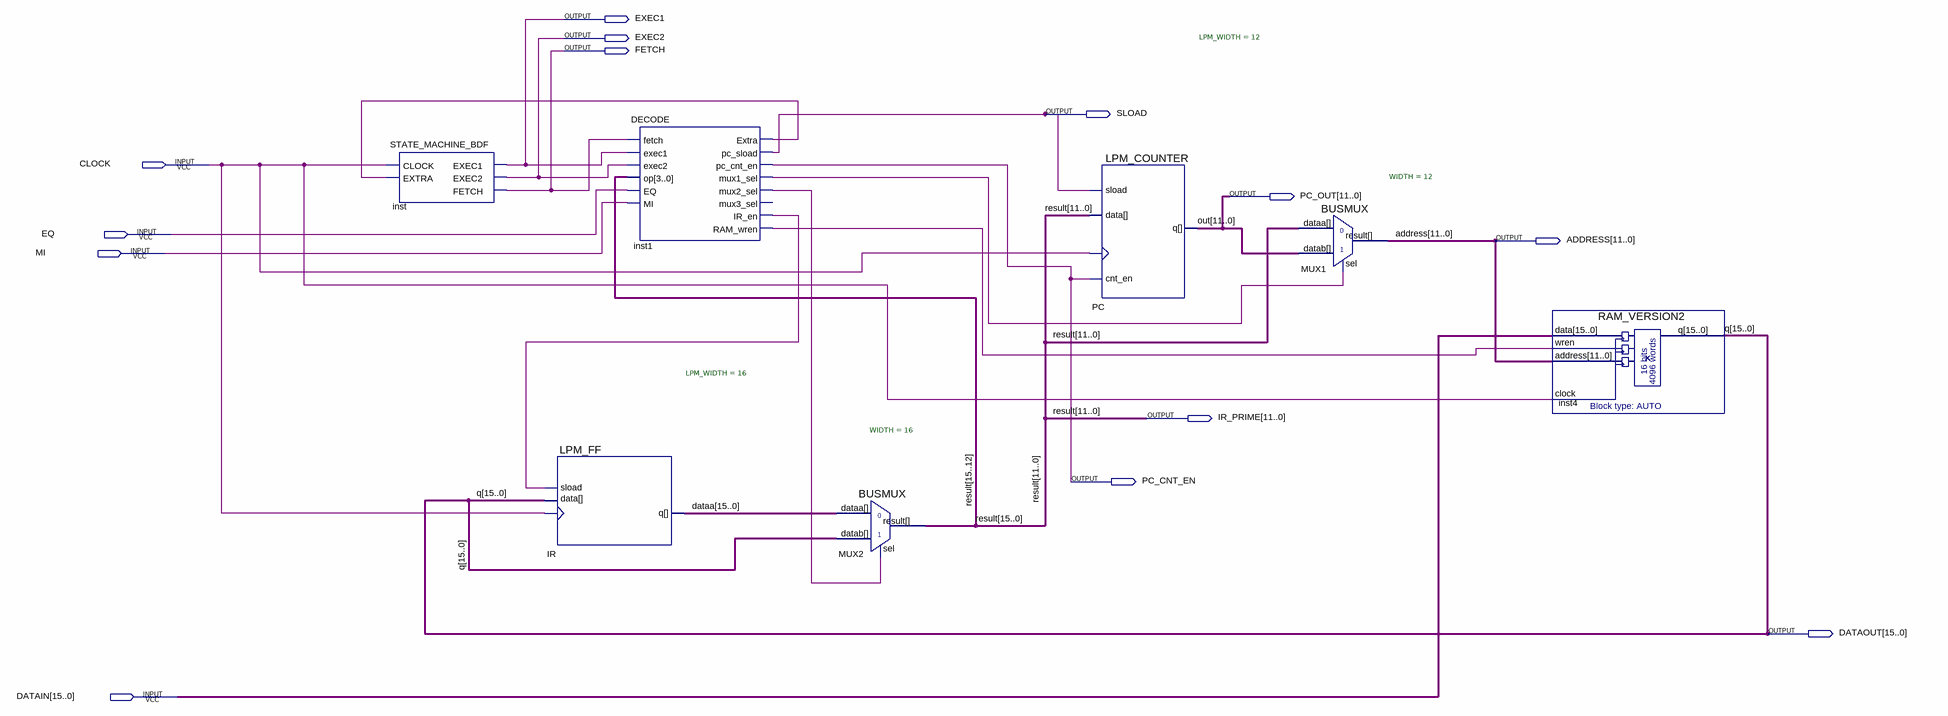
[diagram p0: schematic sheet]
// Quartus schematic TASK5.bdf as structural Verilog: 7 symbols, 13 pins
module TASK5 (
  input  CLOCK,
  input  EQ,
  input  MI,
  input  [15:0] DATAIN,
  output EXEC1,
  output EXEC2,
  output FETCH,
  output SLOAD,
  output [11:0] PC_OUT,
  output [11:0] ADDRESS,
  output [11:0] IR_PRIME,
  output PC_CNT_EN,
  output [15:0] DATAOUT
);

  wire inst1_extra, inst1_ir_en, inst1_mux1_sel, inst1_mux2_sel, inst1_ram_wren;
  wire [15:0] dataa;
  wire [15:12] result;

  STATE_MACHINE_BDF inst (.CLOCK(CLOCK), .EXTRA(inst1_extra), .EXEC1(EXEC1), .EXEC2(EXEC2), .FETCH(FETCH));
  LPM_FF #(.LPM_WIDTH(16)) IR (.clock(CLOCK), .data(DATAOUT), .sload(inst1_ir_en), .q(dataa));
  DECODE inst1 (
    .fetch(FETCH), .exec1(EXEC1), .exec2(EXEC2), .op(result), .EQ(EQ), .MI(MI), .Extra(inst1_extra),
    .pc_sload(SLOAD), .pc_cnt_en(PC_CNT_EN), .mux1_sel(inst1_mux1_sel), .mux2_sel(inst1_mux2_sel),
    .IR_en(inst1_ir_en), .RAM_wren(inst1_ram_wren));  // open: mux3_sel
  BUSMUX #(.WIDTH(16)) MUX2 (.datab(DATAOUT), .sel(inst1_mux2_sel), .dataa(dataa), .result({result, IR_PRIME}));
  LPM_COUNTER #(.LPM_WIDTH(12)) PC (.clock(CLOCK), .cnt_en(PC_CNT_EN), .data(IR_PRIME), .sload(SLOAD), .q(PC_OUT));
  BUSMUX #(.WIDTH(12)) MUX1 (.datab(PC_OUT), .sel(inst1_mux1_sel), .dataa(IR_PRIME), .result(ADDRESS));
  RAM_VERSION2 inst4 (.data(DATAIN), .wren(inst1_ram_wren), .address(ADDRESS), .clock(CLOCK), .q(DATAOUT));

  // Other names for the same wires on the sheet: q[15:0] = DATAOUT; out[11:0] = PC_OUT; result[11:0] = IR_PRIME
endmodule
